# EasyEDA Pro project ProPrj_ax_driver_2025-11-09.epro, board 1-PCB_MT6835
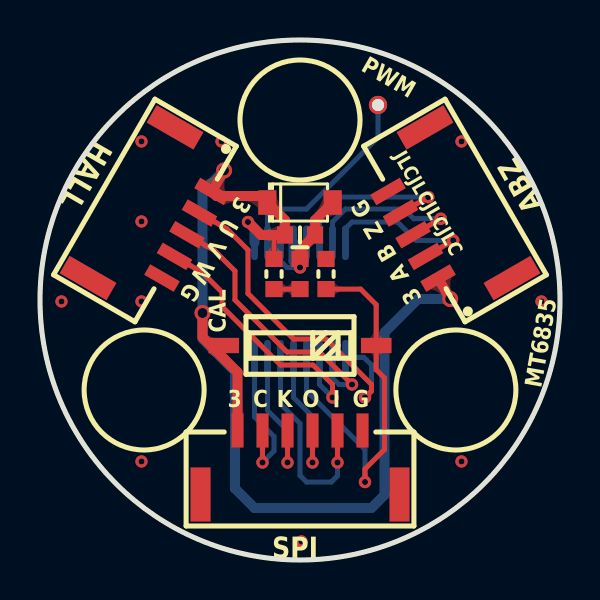
[diagram p2: board, top side]
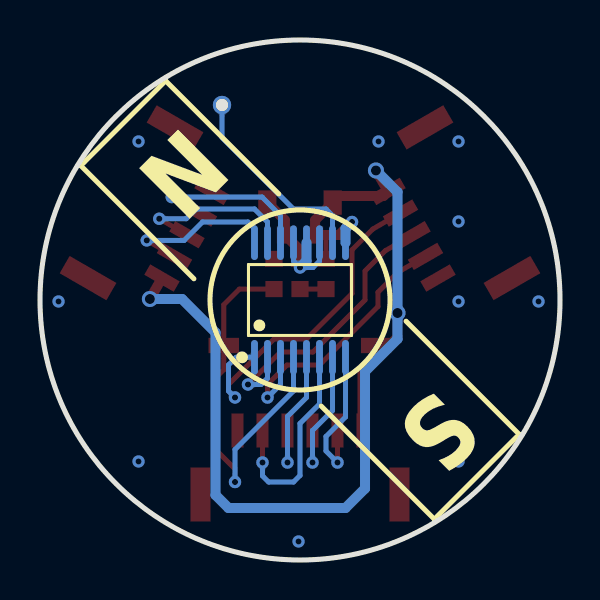
[diagram p3: board, bottom side, seen from below]

Outline 26 x 26 mm; copper layers: Top Layer, Bottom Layer. Coordinates in mm from the lower left corner of the outline.
Outline path: circle c13,13 r13
Stack: Top Layer 0.035mm / Dielectric1 1.51mm FR4 er 4.5 / Bottom Layer 0.035mm

## Design rules (mm)
spacing Default (default): track to track 0.152, other pairs 0 to 0.152
track width Default (default): min 0.152, default 0.152, max 25.4
differential pair differentialPair (default): width min 0.127, default 0.254, max 2.54; gap min 0.152, default 0.152
via Default (default): diameter min 0.508, default 0.508, max 100.025; hole min 0.305, default 0.305, max 59.995
net GND uses gge2148
pour e75 uses gge2154
pour e184 uses gge2148

## Placement (name value [footprint] x y rotation side)
C5  100n  [C0603_SMALL]  13 16.25 0 top
D1  SMFJ5.0A  [SOD-123_L2.7-W1.6-LS3.7-RD]  13 17.87 0 top
LED1  LED-0603_B  [LED0603_BLUE_SMALL]  13 14.3 270 top
NOREF  -  [Pad_e368]  16.9 22.75 60 top
R4  1k  [R0603_SMALL]  11.7 14.3 270 top
R5  1k  [R0603_SMALL]  14.3 14.3 270 top
SW2  DSHP01TSGET  [SW-SMD_DSHP01TSGET]  13 10.72 90 top
U5  WAFER-GH1.25-5PWB  [CONN-SMD_5P-P1.25_X1251WRS-05HF-LPSW#2]  5.96 17.06 240 top
U6  WAFER-GH1.25-5PWB  [CONN-SMD_5P-P1.25_X1251WRS-05HF-LPSW]  20.04 17.06 120 top
U7  WAFER-GH1.25-6PWB  [CONN-SMD_6P-H-P1.25-L_X1251WRS-06HF-LPSW]  13 4.88 0 top
U9  MT6835GT-STD  [TSSOP-16_L5.0-W4.4-P0.65-LS6.4-BL]  13 13 180 bottom

## Footprints (pads in the part's own frame, mm; a bottom-side part is the same pattern mirrored in y, then rotated)
C0603_SMALL
  rect 0.806x0.864 smd: 1(-0.753,0) 2(0.753,0)
CONN-SMD_5P-P1.25_X1251WRS-05HF-LPSW
  rect 0.6x1.7 smd: 1(-2.5,1.6) 2(-1.25,1.6) 3(0,1.6) 4(1.25,1.6) 5(2.5,1.6)
  rect 1x2.7 smd: 6(4.35,-1.6) 7(-4.35,-1.6)
CONN-SMD_5P-P1.25_X1251WRS-05HF-LPSW#2
  rect 0.6x1.7 smd: 1(-2.5,1.6) 2(-1.25,1.6) 3(0,1.6) 4(1.25,1.6) 5(2.5,1.6)
  rect 1x2.7 smd: 6(4.35,-1.6) 7(-4.35,-1.6)
CONN-SMD_6P-H-P1.25-L_X1251WRS-06HF-LPSW
  rect 0.6x1.7 smd: 1(-3.125,1.6) 2(-1.875,1.6) 3(-0.625,1.6) 4(0.625,1.6) 5(1.875,1.6) 6(3.125,1.6)
  rect 1x2.7 smd: 7(4.975,-1.6) 8(-4.975,-1.6)
LED0603_BLUE_SMALL
  rect 0.806x0.864 smd: 1(0.753,0) 2(-0.753,0)
Pad_e368
  round 0.914 hole 0.61: 1(0,0)
R0603_SMALL
  rect 0.806x0.864 smd: 1(-0.753,0) 2(0.753,0)
SOD-123_L2.7-W1.6-LS3.7-RD
  rect 0.91x1.22 smd: 1(-1.635,0) 2(1.635,0)
SW-SMD_DSHP01TSGET
  rect 0.762x1.524 smd: 1(0,3.81) 2(0,-3.81)
TSSOP-16_L5.0-W4.4-P0.65-LS6.4-BL
  oval 0.343x1.732 smd: 1(-2.275,-2.866) 2(-1.625,-2.866) 3(-0.975,-2.866) 4(-0.325,-2.866) 5(0.325,-2.866) 6(0.975,-2.866) 7(1.625,-2.866) 8(2.275,-2.866) 9(2.275,2.866) 10(1.625,2.866) 11(0.975,2.866) 12(0.325,2.866) 13(-0.325,2.866) 14(-0.975,2.866) 15(-1.625,2.866) 16(-2.275,2.866)

## Nets
GND: C5.2 D1.2 LED1.2 R5.1 U5.5 U5.6 U5.7 U6.5 U6.6 U6.7 U7.6 U7.7 U7.8 U9.11 U9.12 U9.13
VCC: C5.1 D1.1 R4.1 SW2.1 U5.1 U6.1 U7.1 U9.9
A: U6.2 U9.16
B: U6.3 U9.15
CSN: U7.2 U9.8
PWM: NOREF.1 U9.10
R4_2: LED1.1 R4.2
SCK: U7.3 U9.7
SDI: U7.5 U9.6
SDO: U7.4 U9.5
U: U5.2 U9.1
U9_4: R5.2 SW2.2 U9.4
V: U5.3 U9.2
W: U5.4 U9.3
Z: U6.4 U9.14

## Via types
v1: diameter 0.61, hole 0.305, Top Layer to Bottom Layer, 10 vias
v2: diameter 0.62, hole 0.31, Top Layer to Bottom Layer, 13 vias
v3: diameter 0.8, hole 0.5, Top Layer to Bottom Layer, 3 vias

## Routing (per net, layer and track width the routed paths; a pad name or vN(x,y) marks a point on that pad's centre or on a via; arc(x,y) is an arc through that point)
GND: length 8.7
  Top Layer w0.5: D1.2 13.75,16.99 13.75,16.25 13,15.5 13,14.63
  Bottom Layer w0.25: 13.32,15.86 13.32,14.95 13,14.63 12.35,14.63 12.02,14.95 12.02,15.86
  Bottom Layer w0.5: 13,14.63 12.68,14.95 12.68,15.86
  vias: v1(1.07,12.93) v1(5.07,20.93) v1(5.07,16.93) v1(5.07,12.93) v1(5.07,4.93) v1(9.07,20.93) v1(13.07,0.93) v1(21.07,20.93) v1(21.07,4.93) v1(25.07,12.93) v2(13,14.62)
VCC: length 56.3
  Top Layer w0.25: 12.25,16.25 11.7,16.25 R4.1
  Top Layer w0.5: 19.9,14.1 20.51,13.05 ; 9.2,19.47 U5.1 8.83,18.2 11.04,18.2 D1.1 12.25,16.99 12.25,16.25 11.05,16.25 v2(10.4,16.9) ; 8.13,12.35 8.13,11.14 9.19,10.07 9.88,9.39 9.88,6.47
  Bottom Layer w0.5: 8.13,12.35 8.13,11.05 9.75,9.43 9.75,3.57 10.72,2.6 16.57,2.6 17.22,3.25 17.22,11.37 18.9,13.05 20.51,13.05 ; v3(8.12,12.35) 8.12,18.4 v3(9.2,19.48) ; v2(10.4,16.9) 10.72,16.58 10.72,15.86
  vias: v3(20.51,13.05)
A: length 8.2
  Top Layer w0.25: 19.28,15.18 20.66,15.98
  Bottom Layer w0.25: 15.28,15.86 15.28,16.58 15.6,16.9 17.87,16.9 18.79,15.98 20.66,15.98
  vias: v2(20.66,15.98)
B: length 8.5
  Top Layer w0.25: 18.65,16.26 v2(20.04,17.06)
  Bottom Layer w0.25: 14.63,15.86 14.63,16.9 15.28,17.55 18.2,17.55 18.69,17.06 v2(20.04,17.06)
CSN: length 7.5
  Top Layer w0.25: 11.13,6.47 11.13,4.87
  Bottom Layer w0.25: 10.72,10.14 10.72,7.15 11.7,6.17 11.7,5.45 11.13,4.87
  vias: v2(11.12,4.88)
PWM: length 10.1
  Bottom Layer w0.25: 11.37,15.86 11.37,17.22 11.7,17.55 13.32,17.55 16.9,21.13 16.9,22.75
R4_2: length 1.3
  Top Layer w0.25: R4.2 LED1.1
SCK: length 7.3
  Top Layer w0.25: 12.38,6.47 12.38,4.87
  Bottom Layer w0.25: 12.38,4.87 12.38,6.47 11.37,7.48 11.37,10.14
  vias: v2(12.38,4.88)
SDI: length 10.7
  Top Layer w0.25: 14.87,6.47 14.87,4.87
  Bottom Layer w0.25: 12.02,10.14 12.02,7.8 13,6.83 13,4.22 13.32,3.9 14.57,3.9 14.87,4.21 14.87,4.87
  vias: v2(14.88,4.88)
SDO: length 7.3
  Top Layer w0.25: 13.62,6.47 13.62,4.87
  Bottom Layer w0.25: 13.62,4.87 13.62,7.18 12.68,8.13 12.68,10.14
  vias: v2(13.62,4.88)
U: length 17.3
  Top Layer w0.25: 16.25,8.13 16.57,8.45 16.57,8.78 14.3,11.05 12.68,11.05 10.4,13.33 10.4,15.51 9.36,16.55 U5.2
  Bottom Layer w0.25: 15.28,10.14 16.19,10.14 16.57,9.75 16.57,8.45 16.25,8.13
  vias: v2(16.25,8.12)
U9_4: length 19.7
  Top Layer w0.25: 16.25,3.9 16.25,4.55 17.22,5.53 17.22,9.1 16.81,9.52 16.81,12.76 16.03,13.55 R5.2
  Bottom Layer w0.25: 16.25,3.9 16.25,5.53 13.32,8.45 13.32,10.14
  vias: v2(16.25,3.9)
V: length 14.2
  Top Layer w0.25: U5.3 8.74,15.46 9.75,14.45 9.75,13 12.35,10.4 13.98,10.4 v2(15.6,8.78)
  Bottom Layer w0.25: v2(15.6,8.78) 14.95,8.78 14.63,9.09 14.63,10.13
W: length 13.8
  Top Layer w0.25: 14.63,8.13 14.63,8.78 13.65,9.75 12.02,9.75 9.1,12.67 9.1,13.39 8.11,14.38 U5.4
  Bottom Layer w0.25: 13.98,10.14 13.98,8.78 14.63,8.13
  vias: v2(14.62,8.12)
Z: length 8.8
  Top Layer w0.25: U6.4 v2(19.41,18.15)
  Bottom Layer w0.25: 13.98,15.86 13.98,17.22 14.9,18.15 v2(19.41,18.15)

## Copper pours and planes (outline as drawn; the poured copper is in the pictures)
GND on Top Layer: -2,28 -2,-2 27.71,-2 27.71,28
GND on Bottom Layer: -2,28 28,28 28,-2 -2,-2

Small or netless copper shapes (teardrops, artwork), in the pictures only: 48 on Top Layer, 34 on Bottom Layer

## Text on the board
Bottom Silkscreen Layer: S | N
Top Silkscreen Layer: JLCJLCJLCJLC | 3 | C | K | O | I | G | MT6835 | CAL | Z | B | A | W | V | U | PWM | SPI | ABZ | HALL
